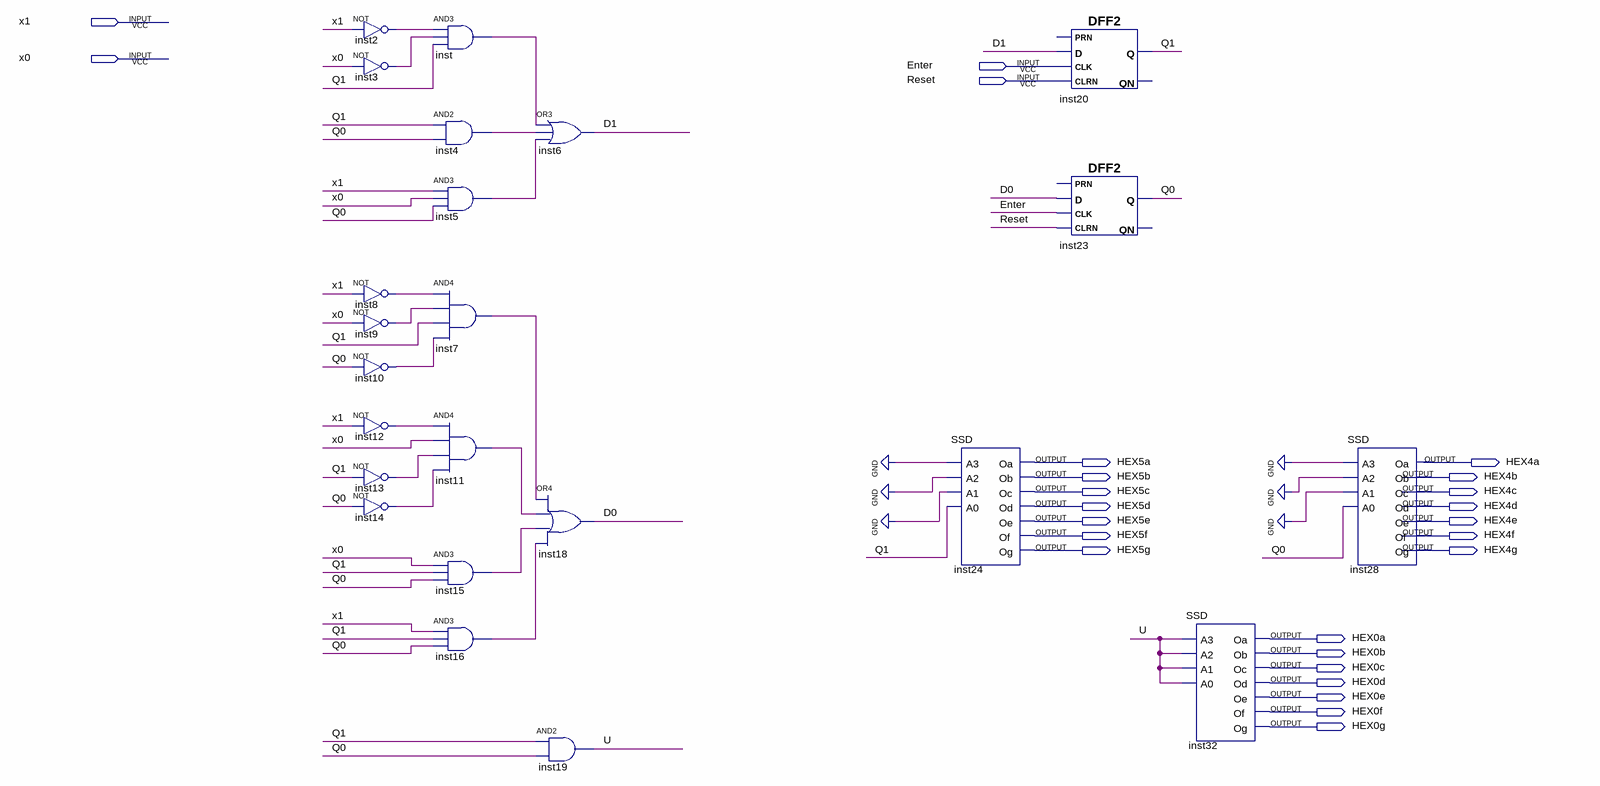
[diagram p0: schematic sheet]
// Quartus schematic homework04.bdf as structural Verilog: 23 symbols, 25 pins
module homework04 (
  input  x1,
  input  x0,
  input  Enter,
  input  Reset,
  output HEX5a,
  output HEX4a,
  output HEX5b,
  output HEX4b,
  output HEX5c,
  output HEX4c,
  output HEX5d,
  output HEX4d,
  output HEX5e,
  output HEX4e,
  output HEX5f,
  output HEX4f,
  output HEX5g,
  output HEX4g,
  output HEX0a,
  output HEX0b,
  output HEX0c,
  output HEX0d,
  output HEX0e,
  output HEX0f,
  output HEX0g
);

  wire D0, D1, inst2_out, inst3_out, inst4_out, inst5_out, inst7_out, inst8_out, inst9_out, inst10_out,
       inst11_out, inst12_out, inst13_out, inst14_out, inst15_out, inst16_out, inst_out, Q0, Q1, U;

  not inst2 (inst2_out, x1);
  not inst3 (inst3_out, x0);
  not inst8 (inst8_out, x1);
  not inst9 (inst9_out, x0);
  not inst10 (inst10_out, Q0);
  not inst12 (inst12_out, x1);
  not inst13 (inst13_out, Q1);
  not inst14 (inst14_out, Q0);
  and inst (inst_out, inst2_out, inst3_out, Q1);
  and inst4 (inst4_out, Q1, Q0);
  and inst5 (inst5_out, x1, x0, Q0);
  and inst7 (inst7_out, inst8_out, inst9_out, Q1, inst10_out);
  and inst11 (inst11_out, inst12_out, x0, inst13_out, inst14_out);
  and inst15 (inst15_out, x0, Q1, Q0);
  and inst16 (inst16_out, x1, Q1, Q0);
  or inst6 (D1, inst_out, inst4_out, inst5_out);
  or inst18 (D0, inst7_out, inst11_out, inst15_out, inst16_out);
  and inst19 (U, Q1, Q0);
  SSD inst24 (
    .A3(1'b0), .A2(1'b0), .A1(1'b0), .A0(Q1), .Oa(HEX5a), .Ob(HEX5b), .Oc(HEX5c), .Od(HEX5d), .Oe(HEX5e),
    .Of(HEX5f), .Og(HEX5g));
  DFF2 inst20 (.CLK(Enter), .D(D1), .CLRN(Reset), .Q(Q1));  // open: PRN, QN
  DFF2 inst23 (.CLK(Enter), .D(D0), .CLRN(Reset), .Q(Q0));  // open: PRN, QN
  SSD inst32 (
    .A3(U), .A2(U), .A1(U), .A0(U), .Oa(HEX0a), .Ob(HEX0b), .Oc(HEX0c), .Od(HEX0d), .Oe(HEX0e), .Of(HEX0f),
    .Og(HEX0g));
  SSD inst28 (
    .A3(1'b0), .A2(1'b0), .A1(1'b0), .A0(Q0), .Oa(HEX4a), .Ob(HEX4b), .Oc(HEX4c), .Od(HEX4d), .Oe(HEX4e),
    .Of(HEX4f), .Og(HEX4g));
endmodule
